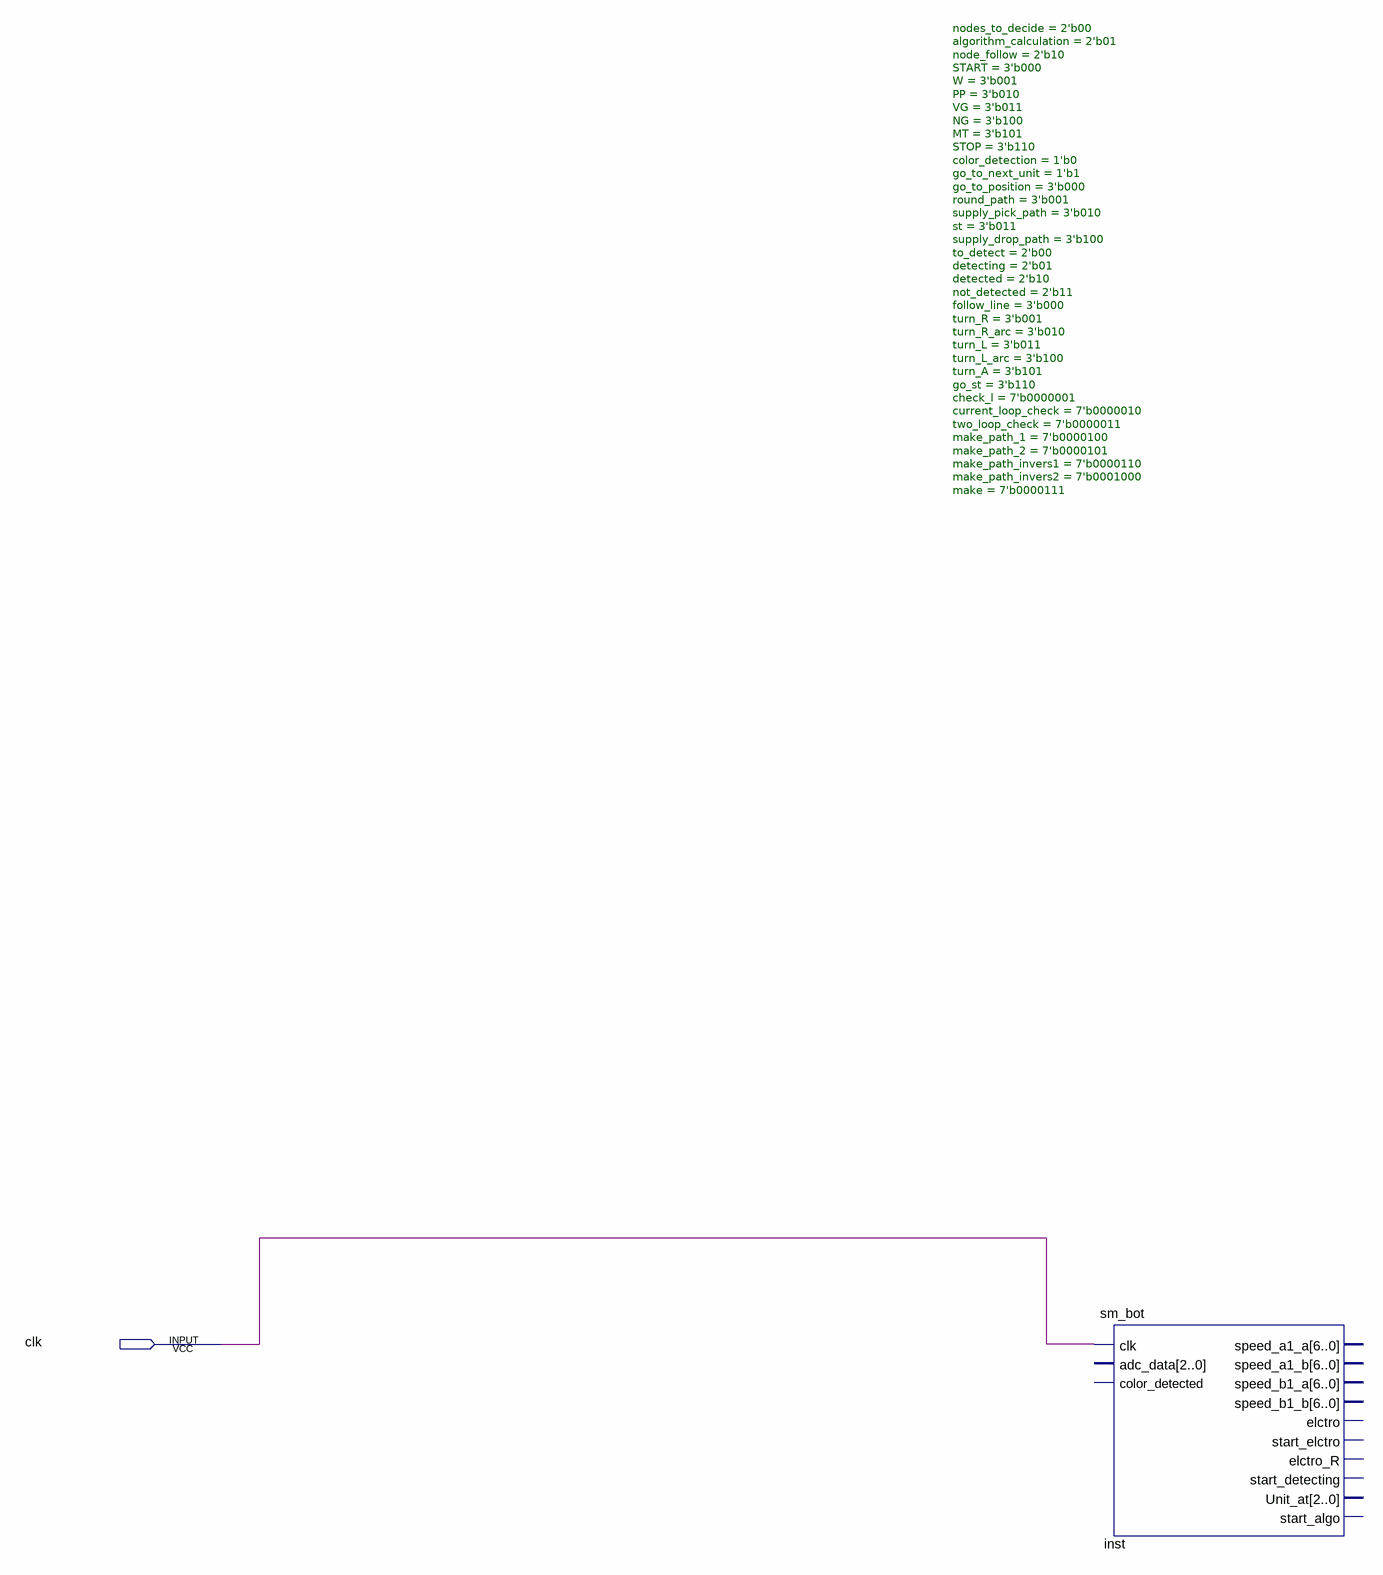
[diagram p0: schematic sheet]
// Quartus schematic block.bdf as structural Verilog: 1 symbols, 1 pins
module block (
  input  clk
);

  sm_bot #(.nodes_to_decide(2'b00), .algorithm_calculation(2'b01), .node_follow(2'b10), .START(3'b000), .W(3'b001), .PP(3'b010), .VG(3'b011), .NG(3'b100), .MT(3'b101), .STOP(3'b110), .color_detection(1'b0), .go_to_next_unit(1'b1), .go_to_position(3'b000), .round_path(3'b001), .supply_pick_path(3'b010), .st(3'b011), .supply_drop_path(3'b100), .to_detect(2'b00), .detecting(2'b01), .detected(2'b10), .not_detected(2'b11), .follow_line(3'b000), .turn_R(3'b001), .turn_R_arc(3'b010), .turn_L(3'b011), .turn_L_arc(3'b100), .turn_A(3'b101), .go_st(3'b110), .check_l(7'b0000001), .current_loop_check(7'b0000010), .two_loop_check(7'b0000011), .make_path_1(7'b0000100), .make_path_2(7'b0000101), .make_path_invers1(7'b0000110), .make_path_invers2(7'b0001000), .make(7'b0000111)) inst (.clk(clk));  // open: adc_data, color_detected, speed_a1_a, speed_a1_b, speed_b1_a, speed_b1_b, elctro, start_elctro, elctro_R, start_detecting, Unit_at, start_algo
endmodule
